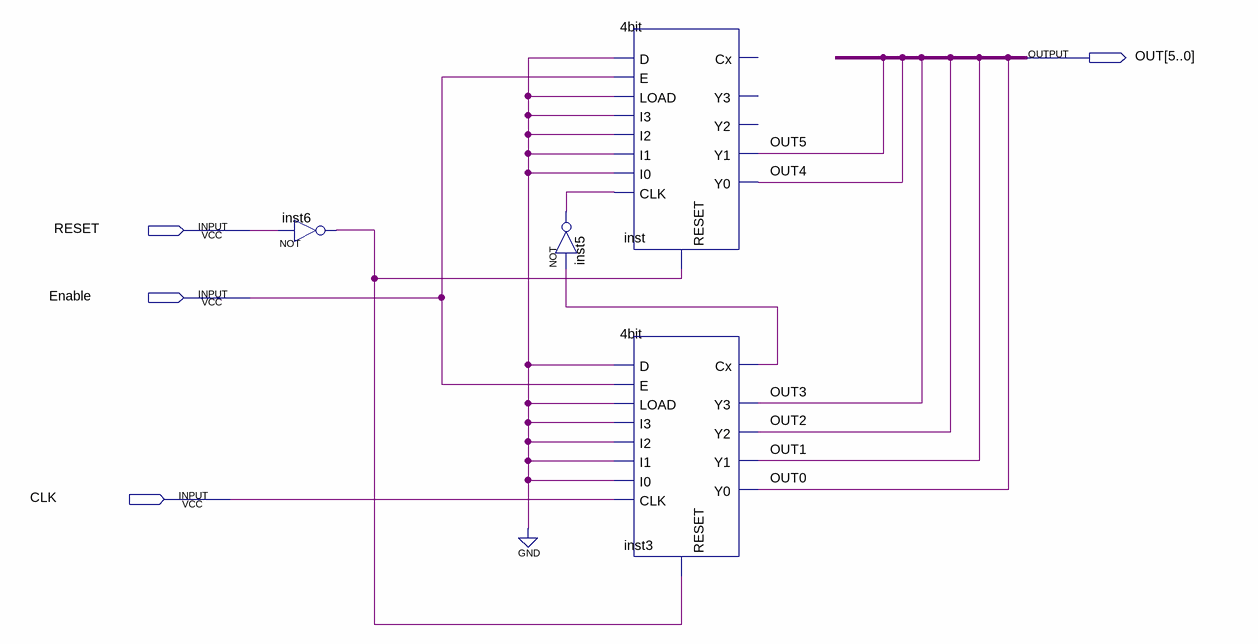
[diagram p0: schematic sheet]
// Quartus schematic Counter_6bit.bdf as structural Verilog: 4 symbols, 4 pins
module Counter_6bit (
  input  RESET,
  input  Enable,
  input  CLK,
  output [5:0] OUT
);

  wire inst3_cx, inst5_out, inst6_out;

  not inst6 (inst6_out, RESET);
  not inst5 (inst5_out, inst3_cx);
  \4bit  inst (
    .D(1'b0), .E(Enable), .LOAD(1'b0), .I3(1'b0), .I2(1'b0), .I1(1'b0), .I0(1'b0), .CLK(inst5_out),
    .RESET(inst6_out), .Y0(OUT[4]), .Y1(OUT[5]));  // open: Cx, Y3, Y2
  \4bit  inst3 (
    .D(1'b0), .E(Enable), .LOAD(1'b0), .I3(1'b0), .I2(1'b0), .I1(1'b0), .I0(1'b0), .CLK(CLK),
    .RESET(inst6_out), .Cx(inst3_cx), .Y3(OUT[3]), .Y2(OUT[2]), .Y0(OUT[0]), .Y1(OUT[1]));
endmodule
